# Altium schematic sheet Relays.SchDoc: RELAY
size A2; DocumentNumber: 5; SheetNumber: 5; SheetTotal: 5
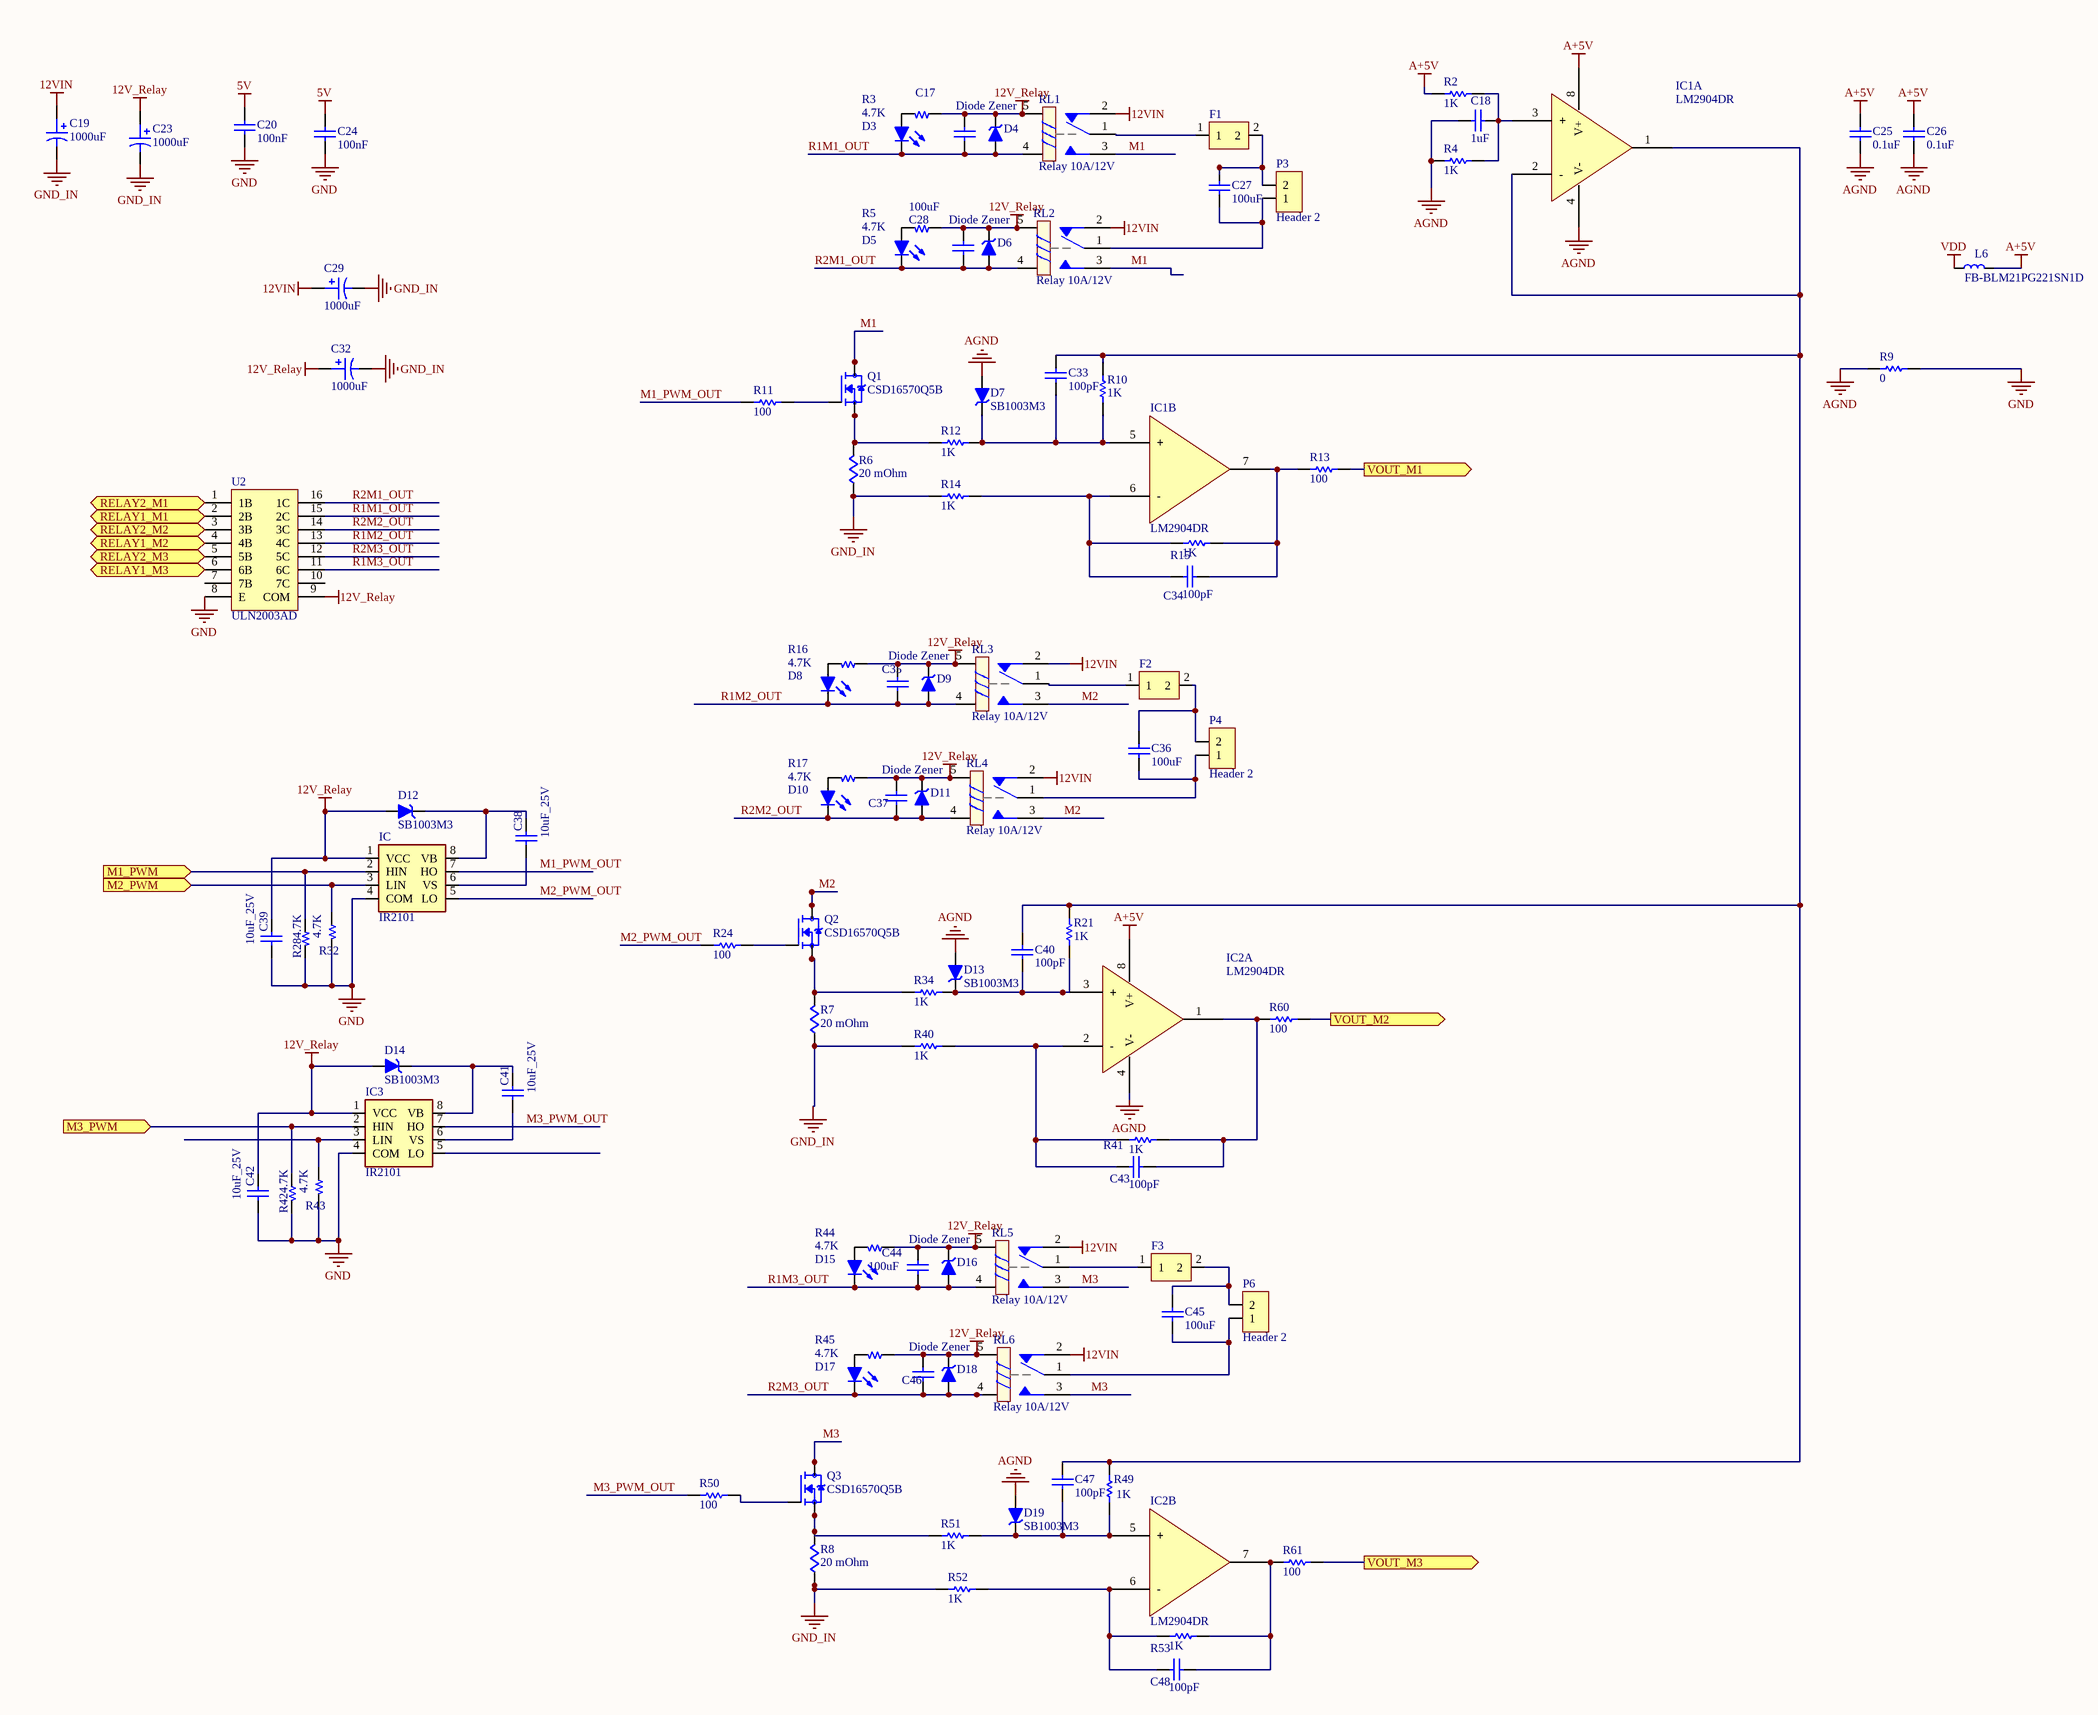
[diagram p0: Relays.SchDoc]

## Parts
C17  Cap Non-pol  [C 0805]  (value not drawn)
C18  value 1uF  [C 0805]  (hidden comment: Cap Non-pol)
C19  value 1000uF  [CAP/D100/H200/LS50]  (hidden comment: Cap Pol)
C20  value 100nF  [C 0805]  (hidden comment: Cap Non-pol)
C23  value 1000uF  [CAP/D100/H200/LS50]  (hidden comment: Cap Pol)
C24  value 100nF  [C 0805]  (hidden comment: Cap Non-pol)
C25  value 0.1uF  [C 0805]  (hidden comment: Cap Non-pol)
C26  value 0.1uF  [C 0805]  (hidden comment: Cap Non-pol)
C27  value 100uF  [CAP Ceramic/W200]  (hidden comment: Cap Non-pol)
C28  value 100uF  [C 0805]  (hidden comment: Cap Non-pol)
C29  value 1000uF  [CAP/D100/H200/LS50]  (hidden comment: Cap Pol)
C32  value 1000uF  [CAP/D100/H200/LS50]  (hidden comment: Cap Pol)
C33  value 100pF  [C 0805]  (hidden comment: Cap Non-pol)
C34  value 100pF  [C 0805]  (hidden comment: Cap Non-pol)
C35  Cap Non-pol  [C 0805]  (value not drawn)
C36  value 100uF  [CAP Ceramic/W200]  (hidden comment: Cap Non-pol)
C37  Cap Non-pol  [C 0805]  (value not drawn)
C38  10uF_25V  [C 0805]
C39  10uF_25V  [C 0805]
C40  value 100pF  [C 0805]  (hidden comment: Cap Non-pol)
C41  10uF_25V  [C 0805]
C42  10uF_25V  [C 0805]
C43  value 100pF  [C 0805]  (hidden comment: Cap Non-pol)
C44  value 100uF  [C 0805]  (hidden comment: Cap Non-pol)
C45  value 100uF  [CAP Ceramic/W200]  (hidden comment: Cap Non-pol)
C46  Cap Non-pol  [C 0805]  (value not drawn)
C47  value 100pF  [C 0805]  (hidden comment: Cap Non-pol)
C48  value 100pF  [C 0805]  (hidden comment: Cap Non-pol)
D3  Led  [Led 0805 RED]  (value not drawn)
D4  Diode Zener  [SOD80C Wave]
D5  Led  [Led 0805 RED]  (value not drawn)
D6  Diode Zener  [SOD80C Wave]
D7  SB1003M3  [DO-214AC (SMA)]
D8  Led  [Led 0805 RED]  (value not drawn)
D9  Diode Zener  [SOD80C Wave]
D10  Led  [Led 0805 RED]  (value not drawn)
D11  Diode Zener  [SOD80C Wave]
D12  SB1003M3  [DO-214AC (SMA)]
D13  SB1003M3  [DO-214AC (SMA)]
D14  SB1003M3  [DO-214AC (SMA)]
D15  Led  [Led 0805 RED]  (value not drawn)
D16  Diode Zener  [SOD80C Wave]
D17  Led  [Led 0805 RED]  (value not drawn)
D18  Diode Zener  [SOD80C Wave]
D19  SB1003M3  [DO-214AC (SMA)]
F1  FUSE_DCAR_HOLDER  [DCAR Fuse holder]  (value not drawn)
F2  FUSE_DCAR_HOLDER  [DCAR Fuse holder]  (value not drawn)
F3  FUSE_DCAR_HOLDER  [DCAR Fuse holder]  (value not drawn)
IC  IR2101  [SOIC-8-I/SN]
IC1  LM2904DR  [SOIC-8-I/SN]  (parts A,B of 2)
IC2  LM2904DR  [SOIC-8-I/SN]  (parts A,B of 2)
IC3  IR2101  [SOIC-8-I/SN]
L6  FB-BLM21PG221SN1D  [L 0805 (2012)]
P3  Header 2  [HDR Domino 2]
P4  Header 2  [HDR Domino 2]
P6  Header 2  [HDR Domino 2]
Q1  CSD16570Q5B  [TRANS_CSD19502Q5BT]
Q2  CSD16570Q5B  [TRANS_CSD19502Q5BT]
Q3  CSD16570Q5B  [TRANS_CSD19502Q5BT]
R2  1K  [R 0805]
R3  4.7K  [R 0805]
R4  1K  [R 0805]
R5  4.7K  [R 0805]
R6  value 20 mOhm  [R2512]  (hidden comment: Resistor2)
R7  value 20 mOhm  [R2512]  (hidden comment: Resistor2)
R8  value 20 mOhm  [R2512]  (hidden comment: Resistor2)
R9  0  [R 0805]
R10  1K  [R 0805]
R11  100  [R 0805]
R12  1K  [R 0805]
R13  100  [R 0805]
R14  1K  [R 0805]
R15  1K  [R 0805]
R16  4.7K  [R 0805]
R17  4.7K  [R 0805]
R21  1K  [R 0805]
R24  100  [R 0805]
R28  4.7K  [R 0805]
R32  4.7K  [R 0805]
R34  1K  [R 0805]
R40  1K  [R 0805]
R41  1K  [R 0805]
R42  4.7K  [R 0805]
R43  4.7K  [R 0805]
R44  4.7K  [R 0805]
R45  4.7K  [R 0805]
R49  1K  [R 0805]
R50  100  [R 0805]
R51  1K  [R 0805]
R52  1K  [R 0805]
R53  1K  [R 0805]
R60  100  [R 0805]
R61  100  [R 0805]
RL1  Relay 10A/12V  [RL_SPDT_20A_SMALL]
RL2  Relay 10A/12V  [RL_SPDT_20A_SMALL]
RL3  Relay 10A/12V  [RL_SPDT_20A_SMALL]
RL4  Relay 10A/12V  [RL_SPDT_20A_SMALL]
RL5  Relay 10A/12V  [RL_SPDT_20A_SMALL]
RL6  Relay 10A/12V  [RL_SPDT_20A_SMALL]
U2  ULN2003AD  [SOIC-16]

## Ports
M1_PWM (in), M2_PWM (in), M3_PWM (in), RELAY1_M1 (in), RELAY1_M2 (in), RELAY1_M3 (in), RELAY2_M1 (in), RELAY2_M2 (in), RELAY2_M3 (in), VOUT_M1 (out), VOUT_M2 (out), VOUT_M3 (out)

## Nets
5V: C20.2 C24.2
12V_Relay: C17.2 C23.1 C28.2 C32.1 C35.2 C37.2 C39.2 C42.2 C44.2 C46.2 D4.2(K) D6.2(K) D9.2(K) D11.2(K) D12.1(A) D14.1(A) D16.2(K) D18.2(K) IC.1(VCC) IC3.1(VCC) R3.1 R5.1 R16.1 R17.1 R44.1 R45.1 RL1.5 RL2.5 RL3.5 RL4.5 RL5.5 RL6.5 U2.9(COM)
12VIN: C19.1 C29.1 RL1.2 RL2.2 RL3.2 RL4.2 RL5.2 RL6.2
A+5V: C25.2 C26.2 IC1.8(V+) IC2.8(V+) L6.2 R2.1
AGND: C18.2 C25.1 C26.1 D7.1(A) D13.1(A) D19.1(A) IC1.4(V-) IC2.4(V-) R4.1 R9.1
GND: C20.1 C24.1 C39.1 C42.1 IC.4(COM) IC3.4(COM) R9.2 R28.2 R32.2 R42.2 R43.2 U2.8(E)
GND_IN: C19.2 C23.2 C29.2 C32.2 R6.1 R7.1 R8.1 R14.2 R40.2 R52.2
VDD: L6.1
M1: Q1.9(D) Q1.9_1(D) Q1.9_2(D) Q1.9_3(D) Q1.9_4(D) Q1.9_5(D) Q1.9_6(D) Q1.9_7(D) RL1.3 RL2.3
M1_PWM: IC.2(HIN) R28.1 ; port M1_PWM
M1_PWM_OUT: IC.7(HO) R11.2
M2: Q2.9(D) Q2.9_1(D) Q2.9_2(D) Q2.9_3(D) Q2.9_4(D) Q2.9_5(D) Q2.9_6(D) Q2.9_7(D) RL3.3 RL4.3
M2_PWM: IC.3(LIN) R32.1 ; port M2_PWM
M2_PWM_OUT: IC.5(LO) R24.2
M3: Q3.9(D) Q3.9_1(D) Q3.9_2(D) Q3.9_3(D) Q3.9_4(D) Q3.9_5(D) Q3.9_6(D) Q3.9_7(D) RL5.3 RL6.3
M3_PWM: IC3.2(HIN) R42.1 ; port M3_PWM
M3_PWM_OUT: IC3.7(HO) R50.2
R1M1_OUT: C17.1 D3.2(K) D4.1(A) RL1.4 U2.15(2C)
R1M2_OUT: C35.1 D8.2(K) D9.1(A) RL3.4 U2.13(4C)
R1M3_OUT: C44.1 D15.2(K) D16.1(A) RL5.4 U2.11(6C)
R2M1_OUT: C28.1 D5.2(K) D6.1(A) RL2.4 U2.16(1C)
R2M2_OUT: C37.1 D10.2(K) D11.1(A) RL4.4 U2.14(3C)
R2M3_OUT: C46.1 D17.2(K) D18.1(A) RL6.4 U2.12(5C)
RELAY1_M1: U2.2(2B) ; port RELAY1_M1
RELAY1_M2: U2.4(4B) ; port RELAY1_M2
RELAY1_M3: U2.6(6B) ; port RELAY1_M3
RELAY2_M1: U2.1(1B) ; port RELAY2_M1
RELAY2_M2: U2.3(3B) ; port RELAY2_M2
RELAY2_M3: U2.5(5B) ; port RELAY2_M3
VOUT_M1: R13.1 ; port VOUT_M1
VOUT_M2: R60.1 ; port VOUT_M2
VOUT_M3: R61.1 ; port VOUT_M3
NetC18_1: C18.1 IC1.3(+) R2.2 R4.2
NetC27_1: C27.1 P3.1 RL2.1
NetC27_2: C27.2 F1.2 P3.2
NetC33_1: C33.1 C40.1 C47.1 IC1.1(OUTA) IC1.2(-) R10.1 R21.1 R49.1
NetC33_2: C33.2 D7.2(K) IC1.5(+) R10.2 R12.1
NetC34_1: C34.1 IC1.7(OUTB) R13.2 R15.1
NetC34_2: C34.2 IC1.6(-) R14.1 R15.2
NetC36_1: C36.1 P4.1 RL4.1
NetC36_2: C36.2 F2.2 P4.2
NetC38_1: C38.1 IC.6(VS)
NetC38_2: C38.2 D12.2(K) IC.8(VB)
NetC40_2: C40.2 D13.2(K) IC2.3(+) R21.2 R34.1
NetC41_1: C41.1 IC3.6(VS)
NetC41_2: C41.2 D14.2(K) IC3.8(VB)
NetC43_1: C43.1 IC2.1(OUTA) R41.1 R60.2
NetC43_2: C43.2 IC2.2(-) R40.1 R41.2
NetC45_1: C45.1 P6.1 RL6.1
NetC45_2: C45.2 F3.2 P6.2
NetC47_2: C47.2 D19.2(K) IC2.5(+) R49.2 R51.1
NetC48_1: C48.1 IC2.7(OUTB) R53.1 R61.2
NetC48_2: C48.2 IC2.6(-) R52.1 R53.2
NetD3_1: D3.1(A) R3.2
NetD5_1: D5.1(A) R5.2
NetD8_1: D8.1(A) R16.2
NetD10_1: D10.1(A) R17.2
NetD15_1: D15.1(A) R44.2
NetD17_1: D17.1(A) R45.2
NetF1_1: F1.1 RL1.1
NetF2_1: F2.1 RL3.1
NetF3_1: F3.1 RL5.1
NetIC3_3: IC3.3(LIN) R43.1
NetQ1_1: Q1.1(S) Q1.2(S) Q1.3(S) R6.2 R12.2
NetQ1_4: Q1.4(G) R11.1
NetQ2_1: Q2.1(S) Q2.2(S) Q2.3(S) R7.2 R34.2
NetQ2_4: Q2.4(G) R24.1
NetQ3_1: Q3.1(S) Q3.2(S) Q3.3(S) R8.2 R51.2
NetQ3_4: Q3.4(G) R50.1

Not connected (* = marked no-connect by the designer): IC3 5(LO); U2 7(7B) 10(7C)

## Notes on the sheet
- Title
- Size:
- Date:
- File:
- A4
- Number:
- Time:
- Revision:
- Sheet
- of
- NPN
- Lab

## Library data of the parts
C17 C18 C20 C24-C28 C33-C48 = Cap Non-pol: Non-polarized Capacitor; Published: 8-Jun-2000; LatestRevisionDate: 17-Jul-2002; LatestRevisionNote: Re-released for DXP Platform.; PackageReference: RAD-0.3; Publisher: Altium Limited
C19 C23 C29 C32 = Cap Pol: Polarized Capacitor; Published: 8-Jun-2000; LatestRevisionDate: 17-Jul-2002; LatestRevisionNote: Re-released for DXP Platform.; PackageReference: POLAR0.8; Publisher: Altium Limited
D3 D5 D8 D10 D15 D17 = Led: LED RED CLEAR 0805 SMD; PACKAGE: SMD0805; STOCK CODE: HT17-2102SURC; SUPPLIER: tme.vn; TYPE: SMD; STOCK DESC: SMD-0805 High Bright Red Chip LED; UNIT PRICE: 800
D4 D6 D7 D9 D11-D14 D16 D18 D19 = Diode Zener: Zener Diode
  D4 D6 D9 D11 D16 D18: Published: 8-Jun-2000; LatestRevisionDate: 17-Jul-2002; LatestRevisionNote: Re-released for DXP Platform.; PackageReference: DIODE-0.7; Publisher: Altium Limited
IC IC3 = IR2101: Half-Bridge Gate Driver IC Non-Inverting 8-SOIC; MF: Infineon; Availability: Unavailable; Package: DIP-8 International Rectifier; MP: IR2101; SnapEDA_Link: https://www.snapeda.com/parts/IR2101/Infineon%20Technologies/view-part/41866/?ref=snap; Value: *; Price: None
IC1 IC2 = LM2904DR: IC OPAMP GP 2 CIRCUIT 8SOIC; Manufacturer: Texas Instruments; Amplifier Type: General Purpose; Current - Input Bias: 20nA; Current - Output / Channel: 30mA; Current - Supply: 1mA; Gain Bandwidth Product: 700kHz; Number of Circuits: 2; Slew Rate: 0.3V/µs; Voltage - Input Offset: 3mV; Voltage - Supply, Single/Dual (±): 3V ~ 26V, ±1.5V ~ 13V; Part Number: LM2904DR; ComponentLink1Description: Datasheet; ComponentLink1URL: http://www.ti.com/general/docs/suppproductinfo.tsp?distId=10&gotoUrl=http%3A%2F%2Fwww.ti.com%2Flit%2Fgpn%2Flm258a; ComponentLink2Description: DigiKey Link; ComponentLink2URL: http://digikey.com/product-detail/en/texas-instruments/LM2904DR/296-14596-1-ND/555533; Device Package: 8-SOIC (0.154", 3.90mm Width); LastUpdated: 1/9/2020 2:06:28 AM; Lifecycle Status: Active; Minimum Order: 1; Mounting Type: Surface Mount; Operating Temperature: -40°C ~ 125°C; Package / Case: 8-SOIC (0.154", 3.90mm Width); Packaging: ReReel; PartId: 4; Part Status: Active; Price: 0.00; Series: -; Supplier 1: DigiKey; Supplier Part Number 1: 296-14596-1-ND; Supplier Device Package: 8-SOIC
L6 = Inductor
P3 P4 P6 = Header 2: Header, 2-Pin; LatestRevisionDate: 17-Jul-2002; LatestRevisionNote: Re-released for DXP Platform.; Publisher: Altium Limited
Q1-Q3 = CSD17577Q3A: N-Channel 30V 35A _Ta_ 2.8W _Ta_, 53W _Tc_ Surface Mount 8-VSONP _3x3.15_; MF: Texas Instruments; MP: CSD17577Q3A; SnapEDA_Link: https://www.snapeda.com/parts/CSD17577Q3A/Texas%20Instruments/view-part/486367/?ref=snap; Availability: Unavailable; Package: VSON-8 Texas Instruments; Value: *; Price: None
R2 R4 R9-R15 R21 R24 R34 R40 R41 R49-R53 R60 R61 = Resistor: Published: 8-Jun-2000; LatestRevisionDate: 17-Jul-2002; LatestRevisionNote: Re-released for DXP Platform.; PackageReference: AXIAL-0.3; Publisher: Altium Limited
R3 R5 R16 R17 R28 R32 R42-R45 = Resistor: RES SMD 4.7K OHM 1% 1/10W 0805; PACKAGE: SMD0805; STOCK CODE: RM10JTN472; SUPPLIER: tme.vn; TYPE: SMD; STOCK DESC: 4.7K 5% SMD-0805 Resistor; UNIT PRICE: 60
RL1-RL6 = Relay 1: Relay SPDT,10A - 12VDC 5 Pin; Value: Relay SPDT, 10A, 12V
U2 = ULN2003: IC PWR RELAY 7NPN 1:1 16SOIC; BRAND: Texas Instruments; PACKAGE: SOIC-16; PART NO: ULN2003AD; STOCK CODE: ULN2003AD; SUPPLIER: tme.vn; TYPE: SMD; STOCK DESC: TRANS 7 NPN DARL 50V 500MA 16SO; UNIT PRICE: 5000
R6-R8 = Resistor2: Manufacturer: *; Manufacturer Part No: *; Component Type: Resistor; Supplier: *; Order Code: *